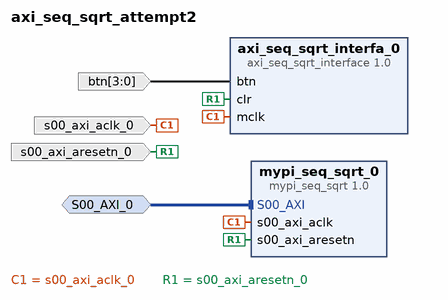
[diagram p0: block diagram of the top level]
# Vivado block design axi_seq_sqrt_attempt2, xc7z020clg400-1, Vivado 2022.1
create_bd_design axi_seq_sqrt_attempt2

create_bd_intf_port -mode Slave -vlnv xilinx.com:interface:aximm_rtl:1.0 S00_AXI_0
set_property -dict [list \
  CONFIG.ADDR_WIDTH 16 \
  CONFIG.ARUSER_WIDTH 0 \
  CONFIG.AWUSER_WIDTH 0 \
  CONFIG.BUSER_WIDTH 0 \
  CONFIG.DATA_WIDTH 32 \
  CONFIG.HAS_BRESP 1 \
  CONFIG.HAS_BURST 0 \
  CONFIG.HAS_CACHE 0 \
  CONFIG.HAS_LOCK 0 \
  CONFIG.HAS_PROT 1 \
  CONFIG.HAS_QOS 0 \
  CONFIG.HAS_REGION 0 \
  CONFIG.HAS_RRESP 1 \
  CONFIG.HAS_WSTRB 1 \
  CONFIG.ID_WIDTH 0 \
  CONFIG.MAX_BURST_LENGTH 1 \
  CONFIG.NUM_READ_OUTSTANDING 1 \
  CONFIG.NUM_READ_THREADS 1 \
  CONFIG.NUM_WRITE_OUTSTANDING 1 \
  CONFIG.NUM_WRITE_THREADS 1 \
  CONFIG.PROTOCOL AXI4LITE \
  CONFIG.READ_WRITE_MODE READ_WRITE \
  CONFIG.RUSER_BITS_PER_BYTE 0 \
  CONFIG.RUSER_WIDTH 0 \
  CONFIG.SUPPORTS_NARROW_BURST 0 \
  CONFIG.WUSER_BITS_PER_BYTE 0 \
  CONFIG.WUSER_WIDTH 0 \
] [get_bd_intf_ports S00_AXI_0]
create_bd_port -dir I -type clk s00_axi_aclk_0
create_bd_port -dir I -type rst s00_axi_aresetn_0
create_bd_port -dir I -from 3 -to 0 btn

create_bd_cell -type ip -vlnv xilinx.com:user:mypi_seq_sqrt:1.0 mypi_seq_sqrt_0
create_bd_cell -type ip -vlnv xilinx.com:user:axi_seq_sqrt_interface:1.0 axi_seq_sqrt_interfa_0

# ---- connections ----

connect_bd_intf_net -intf_net S00_AXI_0_1 [get_bd_intf_ports S00_AXI_0] [get_bd_intf_pins mypi_seq_sqrt_0/S00_AXI]
connect_bd_net -net btn_0_1 [get_bd_ports btn] [get_bd_pins axi_seq_sqrt_interfa_0/btn]
connect_bd_net -net s00_axi_aclk_0_1 [get_bd_ports s00_axi_aclk_0] \
  [get_bd_pins mypi_seq_sqrt_0/s00_axi_aclk] [get_bd_pins axi_seq_sqrt_interfa_0/mclk]
connect_bd_net -net s00_axi_aresetn_0_1 [get_bd_ports s00_axi_aresetn_0] \
  [get_bd_pins mypi_seq_sqrt_0/s00_axi_aresetn] [get_bd_pins axi_seq_sqrt_interfa_0/clr]

# ---- address map ----
assign_bd_address -offset 0x0000 -range 4K -target_address_space [get_bd_addr_spaces S00_AXI_0] [get_bd_addr_segs mypi_seq_sqrt_0/S00_AXI/S00_AXI_reg]

validate_bd_design
save_bd_design
